# EAGLE design SlotExtenderConverter_Slot60 (EAGLE 7.5.0)
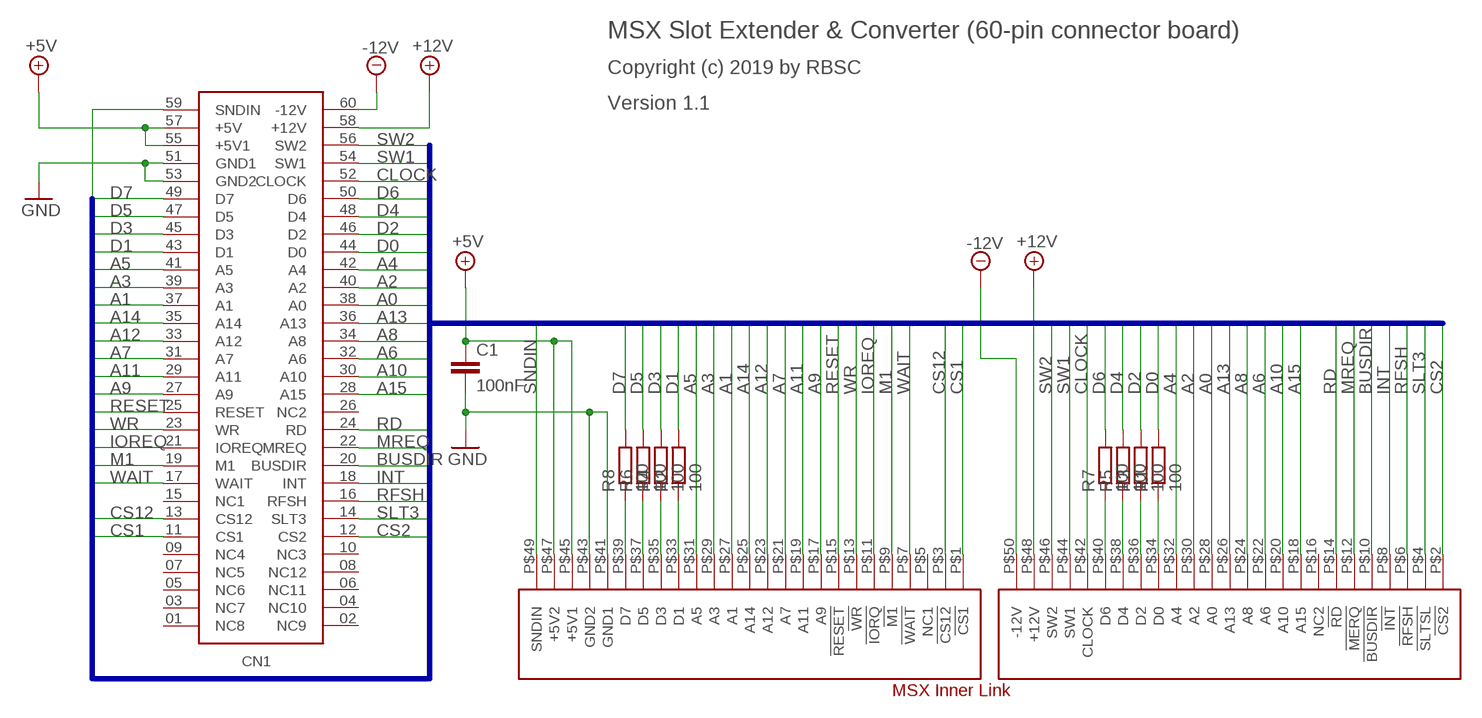
[diagram p0: schematic, sheet 1]

## Parts
C1  100nF  C-EUC0805K  [C0805K]
CN1  MSX_SLOT_CON_60  [MSX_SLOT_CON_60]
CN3  MSX_INNER_LINK  [MSX_INNER_LINK]
R1  100  R-EU_M0805  [M0805]
R2  100  R-EU_M0805  [M0805]
R3  100  R-EU_M0805  [M0805]
R4  100  R-EU_M0805  [M0805]
R5  100  R-EU_M0805  [M0805]
R6  100  R-EU_M0805  [M0805]
R7  100  R-EU_M0805  [M0805]
R8  100  R-EU_M0805  [M0805]

## Nets
+5V: C1.1 CN1.55(+5V1) CN1.57(+5V) CN3.P$45(+5V1) CN3.P$47(+5V2)
+12V: CN1.58(+12V) CN3.P$48(+12V)
-12V: CN1.60(-12V) CN3.P$50(-12V)
A0: CN1.38(A0) CN3.P$28(A0)
A1: CN1.37(A1) CN3.P$27(A1)
A2: CN1.40(A2) CN3.P$30(A2)
A3: CN1.39(A3) CN3.P$29(A3)
A4: CN1.42(A4) CN3.P$32(A4)
A5: CN1.41(A5) CN3.P$31(A5)
A6: CN1.32(A6) CN3.P$22(A6)
A7: CN1.31(A7) CN3.P$21(A7)
A8: CN1.34(A8) CN3.P$24(A8)
A9: CN1.27(A9) CN3.P$17(A9)
A10: CN1.30(A10) CN3.P$20(A10)
A11: CN1.29(A11) CN3.P$19(A11)
A12: CN1.33(A12) CN3.P$23(A12)
A13: CN1.36(A13) CN3.P$26(A13)
A14: CN1.35(A14) CN3.P$25(A14)
A15: CN1.28(A15) CN3.P$18(A15)
BUSDIR: CN1.20(BUSDIR) CN3.P$10(!BUSDIR)
CLOCK: CN1.52(CLOCK) CN3.P$42(CLOCK)
CS1: CN1.11(CS1) CN3.P$1(!CS1)
CS2: CN1.12(CS2) CN3.P$2(!CS2)
CS12: CN1.13(CS12) CN3.P$3(!CS12)
D0: CN1.44(D0) R1.2
D1: CN1.43(D1) R2.2
D2: CN1.46(D2) R3.2
D3: CN1.45(D3) R4.2
D4: CN1.48(D4) R5.2
D5: CN1.47(D5) R6.2
D6: CN1.50(D6) R7.2
D7: CN1.49(D7) R8.2
GND: C1.2 CN1.51(GND1) CN1.53(GND2) CN3.P$41(GND1) CN3.P$43(GND2)
INT: CN1.18(INT) CN3.P$8(!INT)
IOREQ: CN1.21(IOREQ) CN3.P$11(!IORQ)
M1: CN1.19(M1) CN3.P$9(!M1)
MREQ: CN1.22(MREQ) CN3.P$12(!MERQ)
N$1: CN3.P$39(D7) R8.1
N$2: CN3.P$37(D5) R6.1
N$3: CN3.P$35(D3) R4.1
N$4: CN3.P$33(D1) R2.1
N$5: CN3.P$40(D6) R7.1
N$6: CN3.P$38(D4) R5.1
N$7: CN3.P$36(D2) R3.1
N$8: CN3.P$34(D0) R1.1
RD: CN1.24(RD) CN3.P$14(!RD)
RESET: CN1.25(RESET) CN3.P$15(!RESET)
RFSH: CN1.16(RFSH) CN3.P$6(!RFSH)
SLT3: CN1.14(SLT3) CN3.P$4(!SLTSL)
SNDIN: CN1.59(SNDIN) CN3.P$49(SNDIN)
SW1: CN1.54(SW1) CN3.P$44(SW1)
SW2: CN1.56(SW2) CN3.P$46(SW2)
WAIT: CN1.17(WAIT) CN3.P$7(!WAIT)
WR: CN1.23(WR) CN3.P$13(!WR)
Unconnected: CN1.01(NC8) CN1.02(NC9) CN1.03(NC7) CN1.04(NC10) CN1.05(NC6) CN1.06(NC11) CN1.07(NC5) CN1.08(NC12) CN1.09(NC4) CN1.10(NC3) CN1.15(NC1) CN1.26(NC2) CN3.P$5(NC1) CN3.P$16(NC2)

## Buses
D0,D1,D2,D3,D4,D5,D6,D7,A0,A1,A2,A3,A4,A5,A6,A7,A8,A9,A10,A11,A12,A13,A14,A15,CS1,CS2,CS12,SLT3,RFSH,WAIT,INT,M1,BUSDIR,IOREQ,MREQ,WR,RD,RESET,GND,CLOCK,SW1,SW2,SNDIN

## Notes on the sheet
- MSX Slot Extender & Converter (60-pin connector board)
- Copyright (c) 2019 by RBSC
- Version 1.1

## Library data of the parts
C1 = rcl:C-EU: CAPACITOR, European symbol
CN1 = msx_edge_conn_60:MSX_SLOT_CON_60
CN3 = msx_inner_link:MSX_INNER_LINK
R1-R8 = rcl:R-EU_: RESISTOR, European symbol

## Board
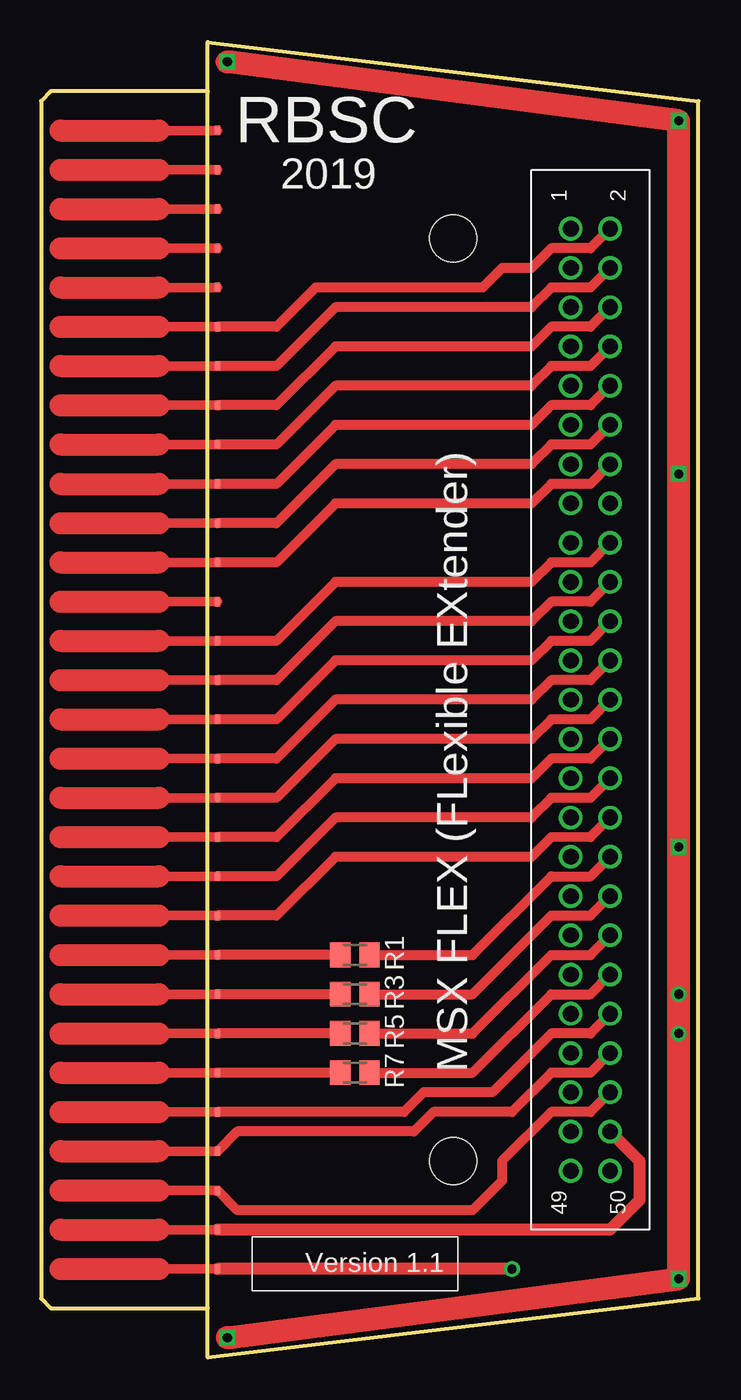
[diagram p1: board, top side]
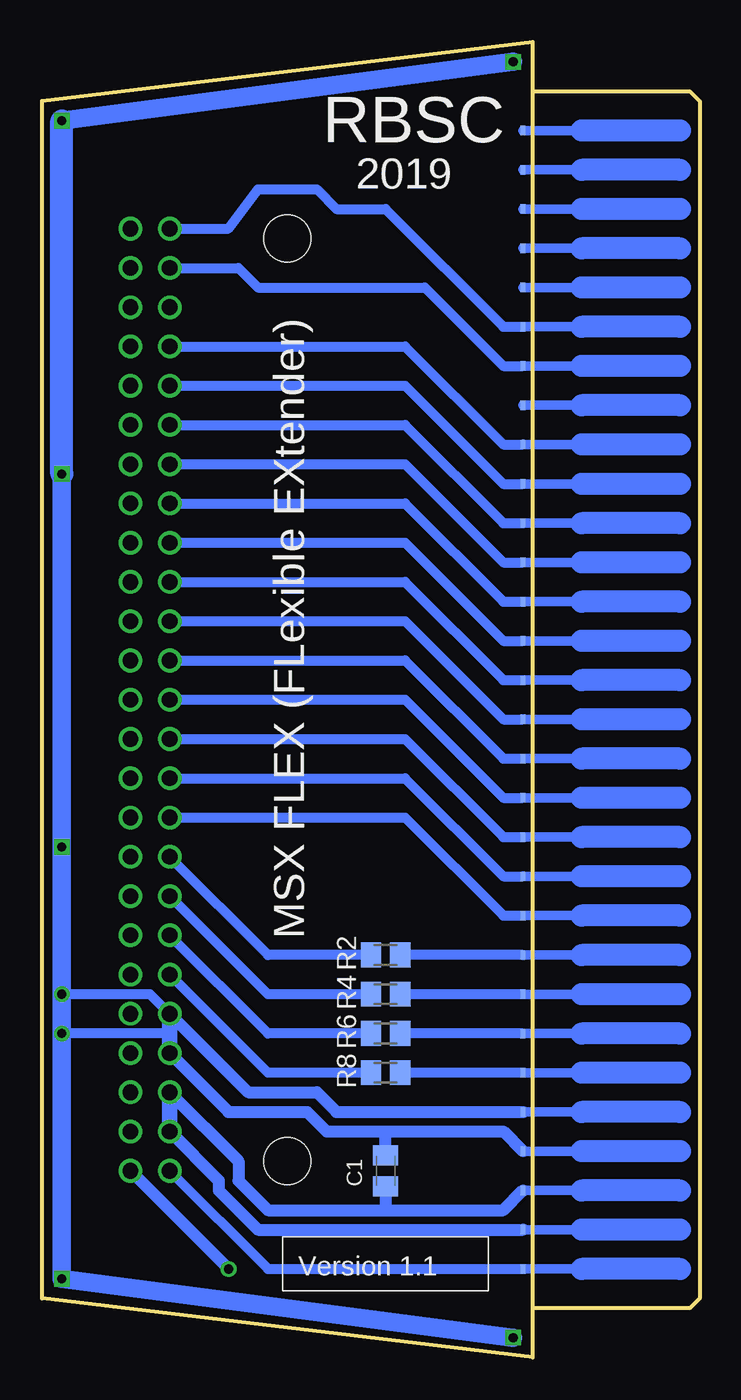
[diagram p2: board, bottom side, seen from below]

Size 42.55 x 85.09 mm. Coordinates in mm from the lower left corner, seen from the top.
Outline: 10.79,3.17 10.79,0 42.55,3.81 42.55,81.28 10.79,85.09 10.79,81.91
Outline: 10.79,3.17 10.79,81.91
Outline: 10.79,81.91 0.63,81.91 0,81.28 0,3.81 0.63,3.17 10.79,3.17
Copper layers (1*16): Top 0.035mm / dielectric 1.5mm / Bottom 0.035mm
Design rules "default *": minimum track width 10mil, minimum drill 24mil, track to track 7mil, track to pad 8mil, pad to pad 8mil, via to via 8mil, smd to smd 8mil, copper to edge 4mil, drill to drill 8mil, minimum pad ring 10mil, minimum via ring 8mil, stop-mask expansion 4mil, vias tented up to drill 24mil, thermal gap 10mil
Holes 3.05 mm at 26.67,72.39 26.67,12.7

### Footprints (pad centres in the part's own frame; a part is rotated, then mirrored left to right if it is on the bottom)
C0805K = smd 1.3 x 1.6: 1 -1,0; 2 1,0
MSX_SLOT_CON_60 = smd 0.61 x 0.305 bottom: 01 -30.48,11.43; 03 -27.94,11.43; 05 -25.4,11.43; 07 -22.86,11.43; 09 -20.32,11.43; 11 -17.78,11.43; 13 -15.24,11.43; 15 -12.7,11.43; 17 -10.16,11.43; 19 -7.62,11.43; 21 -5.08,11.43; 23 -2.54,11.43; 25 0,11.43; 27 2.54,11.43; 29 5.08,11.43; 31 7.62,11.43; 33 10.16,11.43; 35 12.7,11.43; 37 15.24,11.43; 39 17.78,11.43; 41 20.32,11.43; 43 22.86,11.43; 45 25.4,11.43; 47 27.94,11.43; 49 30.48,11.43; 51 33.02,11.43; 53 35.56,11.43; 55 38.1,11.43; 57 40.64,11.43; 59 43.18,11.43 | smd 0.61 x 0.305: 02 -30.48,11.43; 04 -27.94,11.43; 06 -25.4,11.43; 08 -22.86,11.43; 10 -20.32,11.43; 12 -17.78,11.43; 14 -15.24,11.43; 16 -12.7,11.43; 18 -10.16,11.43; 20 -7.62,11.43; 22 -5.08,11.43; 24 -2.54,11.43; 26 0,11.43; 28 2.54,11.43; 30 5.08,11.43; 32 7.62,11.43; 34 10.16,11.43; 36 12.7,11.43; 38 15.24,11.43; 40 17.78,11.43; 42 20.32,11.43; 44 22.86,11.43; 46 25.4,11.43; 48 27.94,11.43; 50 30.48,11.43; 52 33.02,11.43; 54 35.56,11.43; 56 38.1,11.43; 58 40.64,11.43; 60 43.18,11.43
MSX_INNER_LINK = drill 1.016: P$1 63.5,5.08; P$2 63.5,2.54; P$3 60.96,5.08; P$4 60.96,2.54; P$5 58.42,5.08; P$6 58.42,2.54; P$7 55.88,5.08; P$8 55.88,2.54; P$9 53.34,5.08; P$10 53.34,2.54; P$11 50.8,5.08; P$12 50.8,2.54; P$13 48.26,5.08; P$14 48.26,2.54; P$15 45.72,5.08; P$16 45.72,2.54; P$17 43.18,5.08; P$18 43.18,2.54; P$19 40.64,5.08; P$20 40.64,2.54; P$21 38.1,5.08; P$22 38.1,2.54; P$23 35.56,5.08; P$24 35.56,2.54; P$25 33.02,5.08; P$26 33.02,2.54; P$27 30.48,5.08; P$28 30.48,2.54; P$29 27.94,5.08; P$30 27.94,2.54; P$31 25.4,5.08; P$32 25.4,2.54; P$33 22.86,5.08; P$34 22.86,2.54; P$35 20.32,5.08; P$36 20.32,2.54; P$37 17.78,5.08; P$38 17.78,2.54; P$39 15.24,5.08; P$40 15.24,2.54; P$41 12.7,5.08; P$42 12.7,2.54; P$43 10.16,5.08; P$44 10.16,2.54; P$45 7.62,5.08; P$46 7.62,2.54; P$47 5.08,5.08; P$48 5.08,2.54; P$49 2.54,5.08; P$50 2.54,2.54
M0805 = smd 1.3 x 1.6: 1 -0.95,0; 2 0.95,0

### Placement (x,y rotation side)
C1  20.32,12.06 90 bottom
CN1  0,48.89 270 top
CN3  39.37,9.52 90 top
R1  20.32,26.03 180 top
R2  20.32,26.03 0 bottom
R3  20.32,23.49 180 top
R4  20.32,23.49 0 bottom
R5  20.32,20.95 180 top
R6  20.32,20.95 0 bottom
R7  20.32,18.41 180 top
R8  20.32,18.41 0 bottom

### Tracks (layer width: path | path; a pad name or v marks a point on that pad's centre or on a via)
+5V
  Bottom 0.762: CN3.P$45 29.84,12.7 29.84,11.43 27.94,9.52 20.32,9.52 | 20.32,9.52 12.7,9.52 CN1.55 | CN3.P$47 31.12,11.43 31.12,10.79 28.58,8.25 CN1.57 | C1.1 20.32,9.52
  Bottom 1.016: CN3.P$47 CN3.P$45
+12V
  Top 0.762: CN3.P$48 38.73,12.7 38.73,10.16 36.83,8.25 CN1.58
-12V  (via drill 0.6)
  Top 0.762: v30.48,5.71 CN1.60
  Bottom 0.762: CN3.P$50 v30.48,5.71
A0
  Top 0.635: CN3.P$28 35.56,38.73 33.02,38.73 31.75,37.46 19.05,37.46 15.24,33.66 CN1.38
A1
  Bottom 0.635: CN3.P$27 19.05,40 12.7,33.66 CN1.37
A2
  Top 0.635: CN3.P$30 35.56,36.2 33.02,36.2 31.75,34.92 19.05,34.92 15.24,31.12 CN1.40
A3
  Bottom 0.635: CN3.P$29 19.05,37.46 12.7,31.12 CN1.39
A4
  Top 0.61: 35.56,33.66 33.02,33.66
  Top 0.635: CN3.P$32 35.56,33.66 | 33.02,33.66 31.75,32.38 19.05,32.38 15.24,28.57 CN1.42
A5
  Bottom 0.635: CN3.P$31 19.05,34.92 12.7,28.57 CN1.41
A6
  Top 0.635: CN3.P$22 35.56,46.36 33.02,46.36 31.75,45.09 19.05,45.09 15.24,41.27 CN1.32
A7
  Bottom 0.635: CN3.P$21 19.05,47.62 12.7,41.27 CN1.31
A8
  Top 0.635: CN3.P$24 35.56,43.81 33.02,43.81 31.75,42.55 19.05,42.55 15.24,38.73 CN1.34
A9
  Bottom 0.635: CN3.P$17 19.05,52.7 12.7,46.36 CN1.27
A10
  Top 0.635: CN3.P$20 35.56,48.89 33.02,48.89 31.75,47.62 19.05,47.62 15.24,43.81 CN1.30
A11
  Bottom 0.635: CN3.P$19 19.05,50.16 12.7,43.81 CN1.29
A12
  Bottom 0.635: CN3.P$23 19.05,45.09 12.7,38.73 CN1.33
A13
  Top 0.635: CN3.P$26 35.56,41.27 33.02,41.27 31.75,40 19.05,40 15.24,36.2 CN1.36
A14
  Bottom 0.635: CN3.P$25 19.05,42.55 12.7,36.2 CN1.35
A15
  Top 0.635: CN3.P$18 35.56,51.44 33.02,51.44 31.75,50.16 19.05,50.16 15.24,46.36 CN1.28
BUSDIR
  Top 0.635: CN3.P$10 35.56,61.59 33.02,61.59 31.75,60.33 19.05,60.33 15.24,56.52 CN1.20
CLOCK
  Top 0.635: CN3.P$42 35.56,20.95 33.02,20.95 29.21,17.14 24.77,17.14 23.49,15.88 CN1.52
CS1
  Bottom 0.635: CN3.P$1 30.48,73.03 28.58,75.56 24.77,75.56 23.49,74.3 20.32,74.3 12.7,66.67 CN1.11
CS2
  Top 0.635: CN3.P$2 35.56,71.75 33.02,71.75 31.75,70.48 29.84,70.48 28.58,69.22 17.78,69.22 15.24,66.67 CN1.12
CS12
  Bottom 0.635: CN3.P$3 29.84,70.48 28.58,69.22 17.78,69.22 12.7,64.14 CN1.13
D0
  Top 0.635: R1.2 CN1.44
D1
  Bottom 0.635: CN1.43 R2.2
D2
  Top 0.635: R3.2 CN1.46
D3
  Bottom 0.635: CN1.45 R4.2
D4
  Top 0.635: R5.2 CN1.48
D5
  Bottom 0.635: CN1.47 R6.2
D6
  Top 0.635: R7.2 CN1.50
D7
  Bottom 0.635: CN1.49 R8.2
GND  (via drill 0.6)
  Top 1.016: v12.06,83.82 11.79,83.82
  Top 1.5: v12.06,1.27 v41.27,5.08 v41.27,20.95 v41.27,23.49 v41.27,33.02 v41.27,57.15 v41.27,80.01 v12.06,83.82
  Bottom 0.635: 34.29,20.95 v41.27,20.95 | CN3.P$41 35.56,23.49 v41.27,23.49
  Bottom 0.762: CN3.P$43 30.48,15.88 25.4,15.88 24.13,14.6 20.32,14.6 | CN3.P$41 29.21,17.14 24.77,17.14 23.49,15.88 CN1.51 | 20.32,14.6 12.7,14.6 CN1.53 | C1.2 20.32,14.6
  Bottom 1.016: CN3.P$41 34.29,20.95 CN3.P$43
  Bottom 1.2: v12.06,83.82 v41.27,80.01 | 41.27,62.86 v41.27,57.15 v41.27,33.02 v41.27,23.49 v41.27,20.95 v41.27,5.08 v12.06,1.27
  Bottom 1.5: v41.27,57.15 v41.27,80.01
INT
  Top 0.635: CN3.P$8 35.56,64.14 33.02,64.14 31.75,62.86 19.05,62.86 15.24,59.05 CN1.18
IOREQ
  Bottom 0.635: CN3.P$11 19.05,60.33 12.7,53.97 CN1.21
M1
  Bottom 0.635: CN3.P$9 19.05,62.86 12.7,56.52 CN1.19
MREQ
  Top 0.635: CN3.P$12 35.56,59.05 33.02,59.05 31.75,57.78 19.05,57.78 15.24,53.97 CN1.22
N$1
  Bottom 0.635: R8.1 27.94,18.41 CN3.P$39
N$2
  Bottom 0.635: R6.1 27.94,20.95 CN3.P$37
N$3
  Bottom 0.635: R4.1 27.94,23.49 CN3.P$35
N$4
  Bottom 0.635: R2.1 27.94,26.03 CN3.P$33
N$5
  Top 0.635: R7.1 27.94,18.41 33.02,23.49 35.56,23.49 CN3.P$40
N$6
  Top 0.635: R5.1 27.94,20.95 33.02,26.03 35.56,26.03 CN3.P$38
N$7
  Top 0.635: R3.1 27.94,23.49 33.02,28.57 35.56,28.57 CN3.P$36
N$8
  Top 0.635: R1.1 27.94,26.03 33.02,31.12 35.56,31.12 CN3.P$34
RD
  Top 0.635: CN3.P$14 35.56,56.52 33.02,56.52 31.75,55.25 19.05,55.25 15.24,51.44 CN1.24
RESET
  Bottom 0.635: CN3.P$15 19.05,55.25 12.7,48.89 CN1.25
RFSH
  Top 0.635: CN3.P$6 35.56,66.67 33.02,66.67 31.75,65.41 19.05,65.41 15.24,61.59 CN1.16
SLT3
  Top 0.635: CN3.P$4 35.56,69.22 33.02,69.22 31.75,67.94 19.05,67.94 15.24,64.14 CN1.14
SNDIN
  Bottom 0.635: CN3.P$49 27.94,5.71 CN1.59
SW1
  Top 0.635: CN3.P$44 35.56,18.41 33.02,18.41 30.48,15.88 25.4,15.88 24.13,14.6 12.7,14.6 CN1.54
SW2
  Top 0.635: CN3.P$46 35.56,15.88 33.02,15.88 29.84,12.7 29.84,11.43 27.94,9.52 12.7,9.52 CN1.56
WAIT
  Bottom 0.635: CN3.P$7 19.05,65.41 12.7,59.05 CN1.17
WR
  Bottom 0.635: CN3.P$13 19.05,57.78 12.7,51.44 CN1.23

### Text on the board
tNames: RBSC | 2019 | MSX FLEX (FLexible EXtender) | Version 1.1
bNames: RBSC | 2019 | MSX FLEX (FLexible EXtender) | Version 1.1